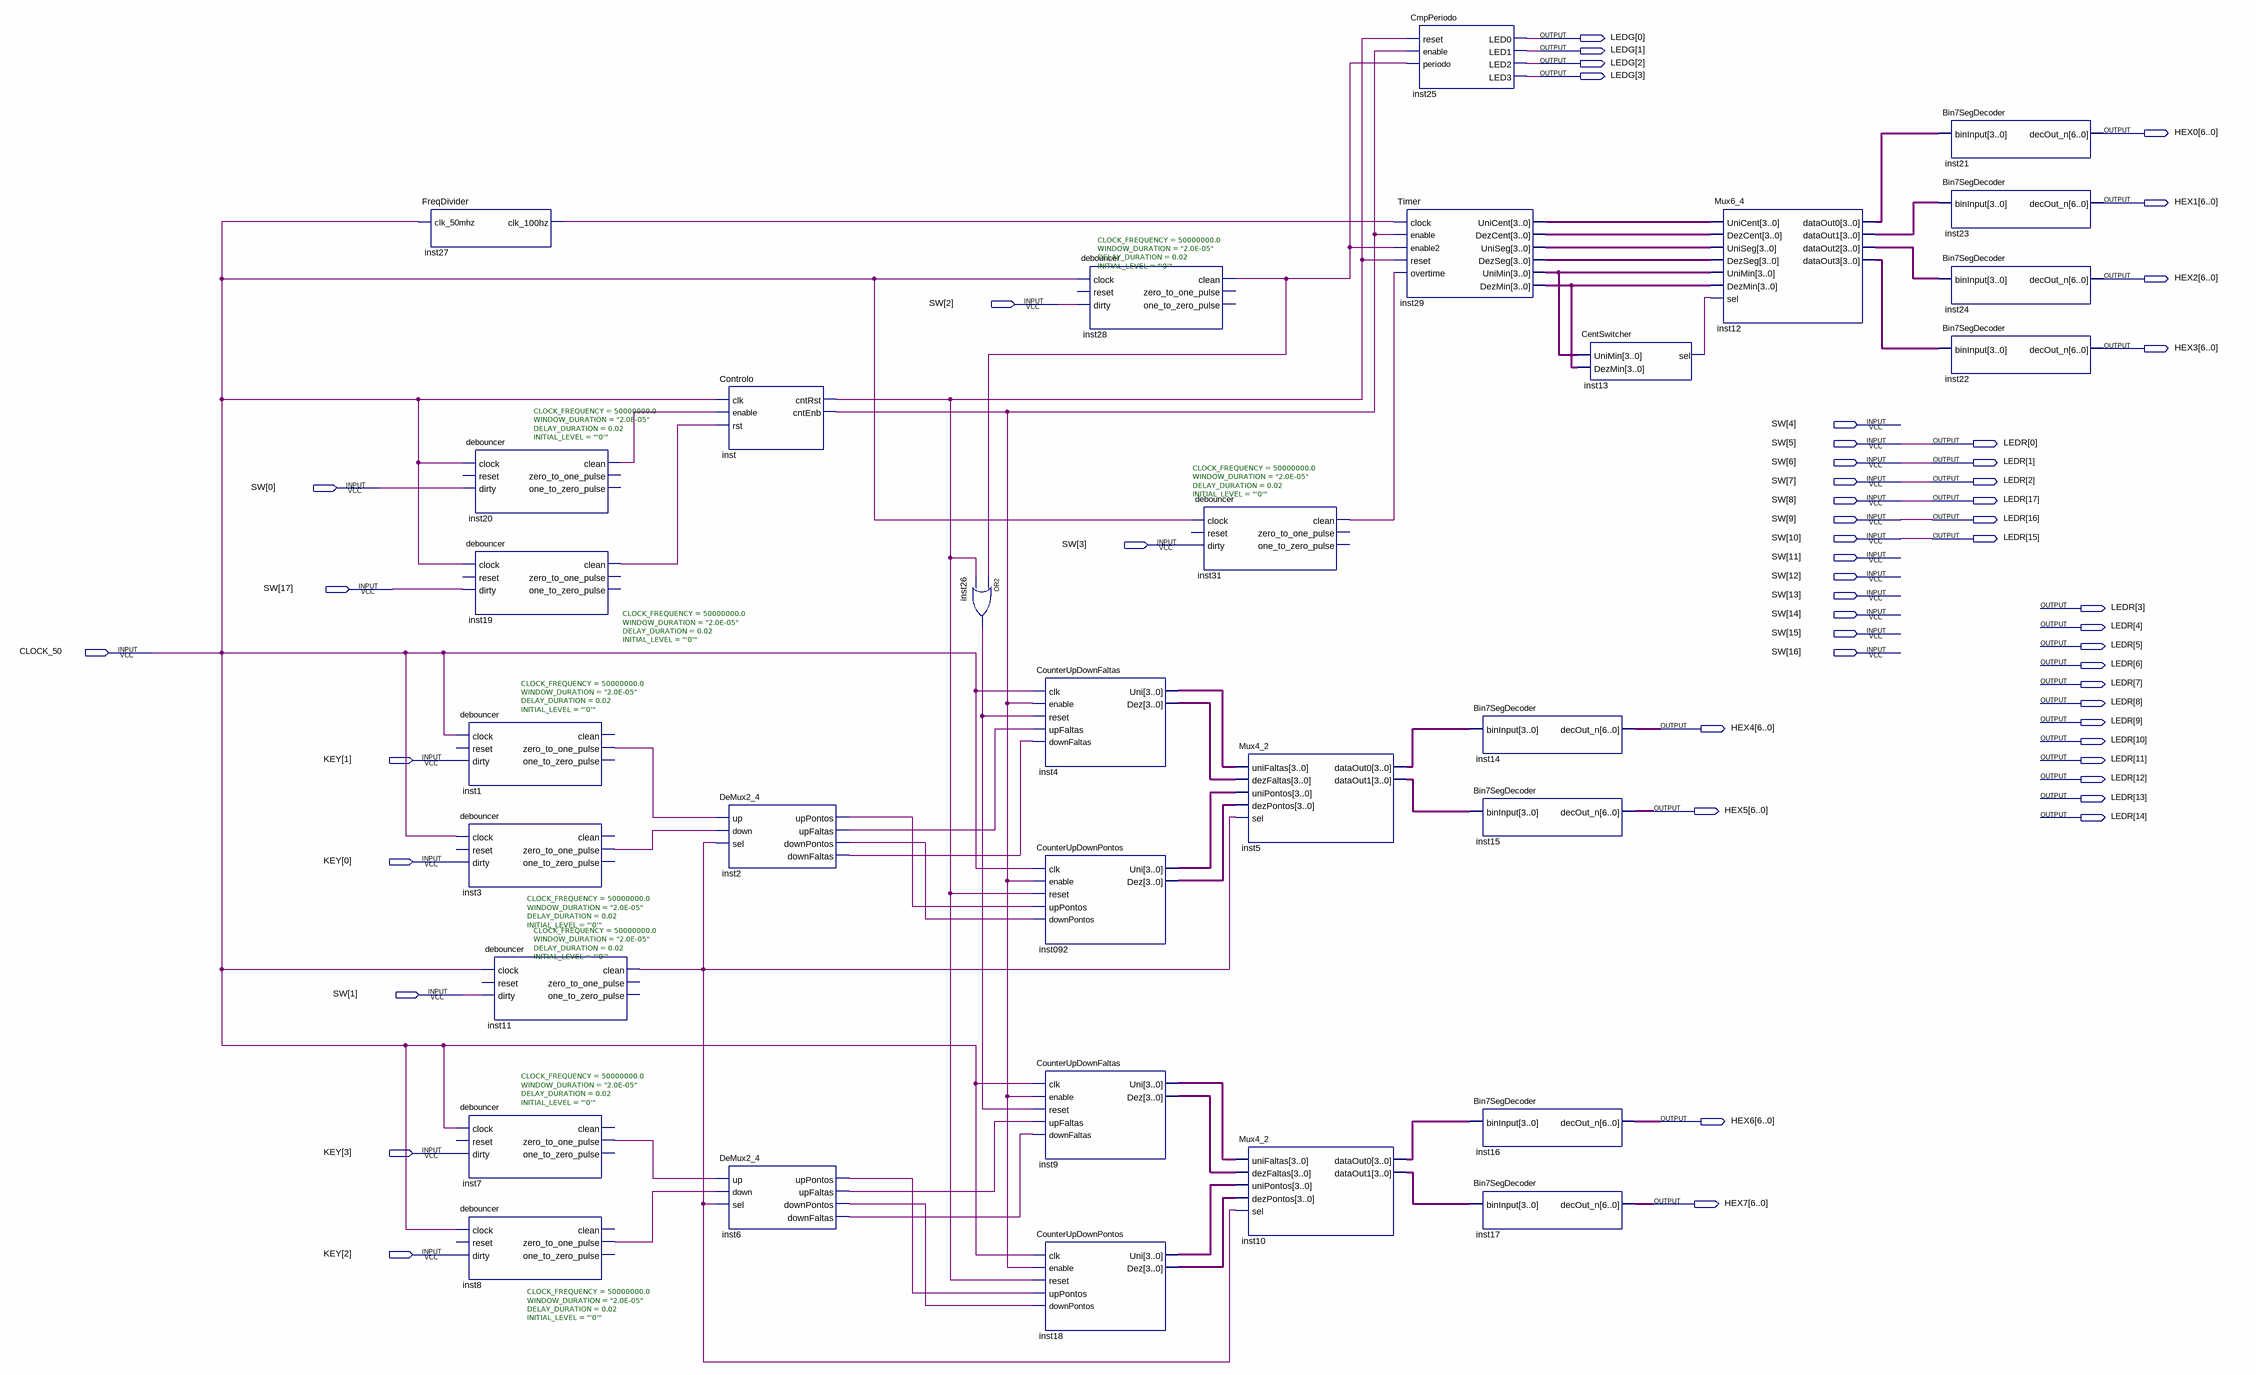
[diagram p0: schematic sheet]
// Quartus schematic Marcador.bdf as structural Verilog: 32 symbols, 53 pins
module Marcador (
  input  [17:0] SW,
  input  CLOCK_50,
  input  [3:0] KEY,
  output [3:0] LEDG,
  output [6:0] HEX0,
  output [6:0] HEX1,
  output [6:0] HEX2,
  output [6:0] HEX3,
  output [17:0] LEDR,
  output [6:0] HEX4,
  output [6:0] HEX5,
  output [6:0] HEX6,
  output [6:0] HEX7
);

  wire inst1_zero_to_one_pulse, inst2_downfaltas, inst2_downpontos, inst2_upfaltas, inst2_uppontos,
       inst3_zero_to_one_pulse, inst6_downfaltas, inst6_downpontos, inst6_upfaltas, inst6_uppontos,
       inst7_zero_to_one_pulse, inst8_zero_to_one_pulse, inst11_clean, inst13_sel, inst19_clean,
       inst20_clean, inst26_out, inst27_clk_100hz, inst28_clean, inst31_clean, inst_cntenb, inst_cntrst;
  wire [3:0] inst4_dez, inst4_uni, inst5_dataout0, inst5_dataout1, inst9_dez, inst9_uni, inst10_dataout0,
       inst10_dataout1, inst12_dataout0, inst12_dataout1, inst12_dataout2, inst12_dataout3, inst18_dez,
       inst18_uni, inst29_dezcent, inst29_dezmin, inst29_dezseg, inst29_unicent, inst29_unimin,
       inst29_uniseg, inst092_dez, inst092_uni;

  FreqDivider inst27 (.clk_50mhz(CLOCK_50), .clk_100hz(inst27_clk_100hz));
  debouncer #(.CLOCK_FREQUENCY(50000000.0), .WINDOW_DURATION("2.0E-05"), .DELAY_DURATION(0.02), .INITIAL_LEVEL("'0'")) inst20 (
    .clock(CLOCK_50), .dirty(SW[0]), .clean(inst20_clean));  // open: reset, zero_to_one_pulse, one_to_zero_pulse
  debouncer #(.CLOCK_FREQUENCY(50000000.0), .WINDOW_DURATION("2.0E-05"), .DELAY_DURATION(0.02), .INITIAL_LEVEL("'0'")) inst19 (
    .clock(CLOCK_50), .dirty(SW[17]), .clean(inst19_clean));  // open: reset, zero_to_one_pulse, one_to_zero_pulse
  debouncer #(.CLOCK_FREQUENCY(50000000.0), .WINDOW_DURATION("2.0E-05"), .DELAY_DURATION(0.02), .INITIAL_LEVEL("'0'")) inst1 (
    .clock(CLOCK_50), .dirty(KEY[1]), .zero_to_one_pulse(inst1_zero_to_one_pulse));  // open: reset, clean, one_to_zero_pulse
  debouncer #(.CLOCK_FREQUENCY(50000000.0), .WINDOW_DURATION("2.0E-05"), .DELAY_DURATION(0.02), .INITIAL_LEVEL("'0'")) inst3 (
    .clock(CLOCK_50), .dirty(KEY[0]), .zero_to_one_pulse(inst3_zero_to_one_pulse));  // open: reset, clean, one_to_zero_pulse
  debouncer #(.CLOCK_FREQUENCY(50000000.0), .WINDOW_DURATION("2.0E-05"), .DELAY_DURATION(0.02), .INITIAL_LEVEL("'0'")) inst7 (
    .clock(CLOCK_50), .dirty(KEY[3]), .zero_to_one_pulse(inst7_zero_to_one_pulse));  // open: reset, clean, one_to_zero_pulse
  debouncer #(.CLOCK_FREQUENCY(50000000.0), .WINDOW_DURATION("2.0E-05"), .DELAY_DURATION(0.02), .INITIAL_LEVEL("'0'")) inst8 (
    .clock(CLOCK_50), .dirty(KEY[2]), .zero_to_one_pulse(inst8_zero_to_one_pulse));  // open: reset, clean, one_to_zero_pulse
  debouncer #(.CLOCK_FREQUENCY(50000000.0), .WINDOW_DURATION("2.0E-05"), .DELAY_DURATION(0.02), .INITIAL_LEVEL("'0'")) inst11 (
    .clock(CLOCK_50), .dirty(SW[1]), .clean(inst11_clean));  // open: reset, zero_to_one_pulse, one_to_zero_pulse
  Controlo inst (.clk(CLOCK_50), .enable(inst20_clean), .rst(inst19_clean), .cntRst(inst_cntrst), .cntEnb(inst_cntenb));
  DeMux2_4 inst2 (
    .up(inst1_zero_to_one_pulse), .down(inst3_zero_to_one_pulse), .sel(inst11_clean),
    .upPontos(inst2_uppontos), .upFaltas(inst2_upfaltas), .downPontos(inst2_downpontos),
    .downFaltas(inst2_downfaltas));
  DeMux2_4 inst6 (
    .up(inst7_zero_to_one_pulse), .down(inst8_zero_to_one_pulse), .sel(inst11_clean),
    .upPontos(inst6_uppontos), .upFaltas(inst6_upfaltas), .downPontos(inst6_downpontos),
    .downFaltas(inst6_downfaltas));
  or inst26 (inst26_out, inst28_clean, inst_cntrst);
  CounterUpDownFaltas inst4 (
    .clk(CLOCK_50), .enable(inst_cntenb), .reset(inst26_out), .upFaltas(inst2_upfaltas),
    .downFaltas(inst2_downfaltas), .Uni(inst4_uni), .Dez(inst4_dez));
  CounterUpDownPontos inst092 (
    .clk(CLOCK_50), .enable(inst_cntenb), .reset(inst_cntrst), .upPontos(inst2_uppontos),
    .downPontos(inst2_downpontos), .Uni(inst092_uni), .Dez(inst092_dez));
  CounterUpDownFaltas inst9 (
    .clk(CLOCK_50), .enable(inst_cntenb), .reset(inst26_out), .upFaltas(inst6_upfaltas),
    .downFaltas(inst6_downfaltas), .Uni(inst9_uni), .Dez(inst9_dez));
  CounterUpDownPontos inst18 (
    .clk(CLOCK_50), .enable(inst_cntenb), .reset(inst_cntrst), .upPontos(inst6_uppontos),
    .downPontos(inst6_downpontos), .Uni(inst18_uni), .Dez(inst18_dez));
  debouncer #(.CLOCK_FREQUENCY(50000000.0), .WINDOW_DURATION("2.0E-05"), .DELAY_DURATION(0.02), .INITIAL_LEVEL("'0'")) inst28 (
    .clock(CLOCK_50), .dirty(SW[2]), .clean(inst28_clean));  // open: reset, zero_to_one_pulse, one_to_zero_pulse
  debouncer #(.CLOCK_FREQUENCY(50000000.0), .WINDOW_DURATION("2.0E-05"), .DELAY_DURATION(0.02), .INITIAL_LEVEL("'0'")) inst31 (
    .clock(CLOCK_50), .dirty(SW[3]), .clean(inst31_clean));  // open: reset, zero_to_one_pulse, one_to_zero_pulse
  Mux4_2 inst5 (
    .uniFaltas(inst4_uni), .dezFaltas(inst4_dez), .uniPontos(inst092_uni), .dezPontos(inst092_dez),
    .sel(inst11_clean), .dataOut0(inst5_dataout0), .dataOut1(inst5_dataout1));
  Mux4_2 inst10 (
    .uniFaltas(inst9_uni), .dezFaltas(inst9_dez), .uniPontos(inst18_uni), .dezPontos(inst18_dez),
    .sel(inst11_clean), .dataOut0(inst10_dataout0), .dataOut1(inst10_dataout1));
  CmpPeriodo inst25 (
    .reset(inst_cntrst), .enable(inst_cntenb), .periodo(inst28_clean), .LED0(LEDG[0]), .LED1(LEDG[1]),
    .LED2(LEDG[2]), .LED3(LEDG[3]));
  Timer inst29 (
    .clock(inst27_clk_100hz), .enable(inst_cntenb), .enable2(inst28_clean), .reset(inst_cntrst),
    .overtime(inst31_clean), .UniCent(inst29_unicent), .DezCent(inst29_dezcent), .UniSeg(inst29_uniseg),
    .DezSeg(inst29_dezseg), .UniMin(inst29_unimin), .DezMin(inst29_dezmin));
  Bin7SegDecoder inst14 (.binInput(inst5_dataout0), .decOut_n(HEX4));
  Bin7SegDecoder inst15 (.binInput(inst5_dataout1), .decOut_n(HEX5));
  Bin7SegDecoder inst16 (.binInput(inst10_dataout0), .decOut_n(HEX6));
  Bin7SegDecoder inst17 (.binInput(inst10_dataout1), .decOut_n(HEX7));
  CentSwitcher inst13 (.UniMin(inst29_unimin), .DezMin(inst29_dezmin), .sel(inst13_sel));
  Mux6_4 inst12 (
    .UniCent(inst29_unicent), .DezCent(inst29_dezcent), .UniSeg(inst29_uniseg), .DezSeg(inst29_dezseg),
    .UniMin(inst29_unimin), .DezMin(inst29_dezmin), .sel(inst13_sel), .dataOut0(inst12_dataout0),
    .dataOut1(inst12_dataout1), .dataOut2(inst12_dataout2), .dataOut3(inst12_dataout3));
  Bin7SegDecoder inst21 (.binInput(inst12_dataout0), .decOut_n(HEX0));
  Bin7SegDecoder inst23 (.binInput(inst12_dataout1), .decOut_n(HEX1));
  Bin7SegDecoder inst24 (.binInput(inst12_dataout2), .decOut_n(HEX2));
  Bin7SegDecoder inst22 (.binInput(inst12_dataout3), .decOut_n(HEX3));

  assign {LEDR[17:15], LEDR[2:0]} = {SW[8], SW[9], SW[10], SW[7:5]};
endmodule
